# Altium schematic sheet Sheet4.SchDoc
size A4
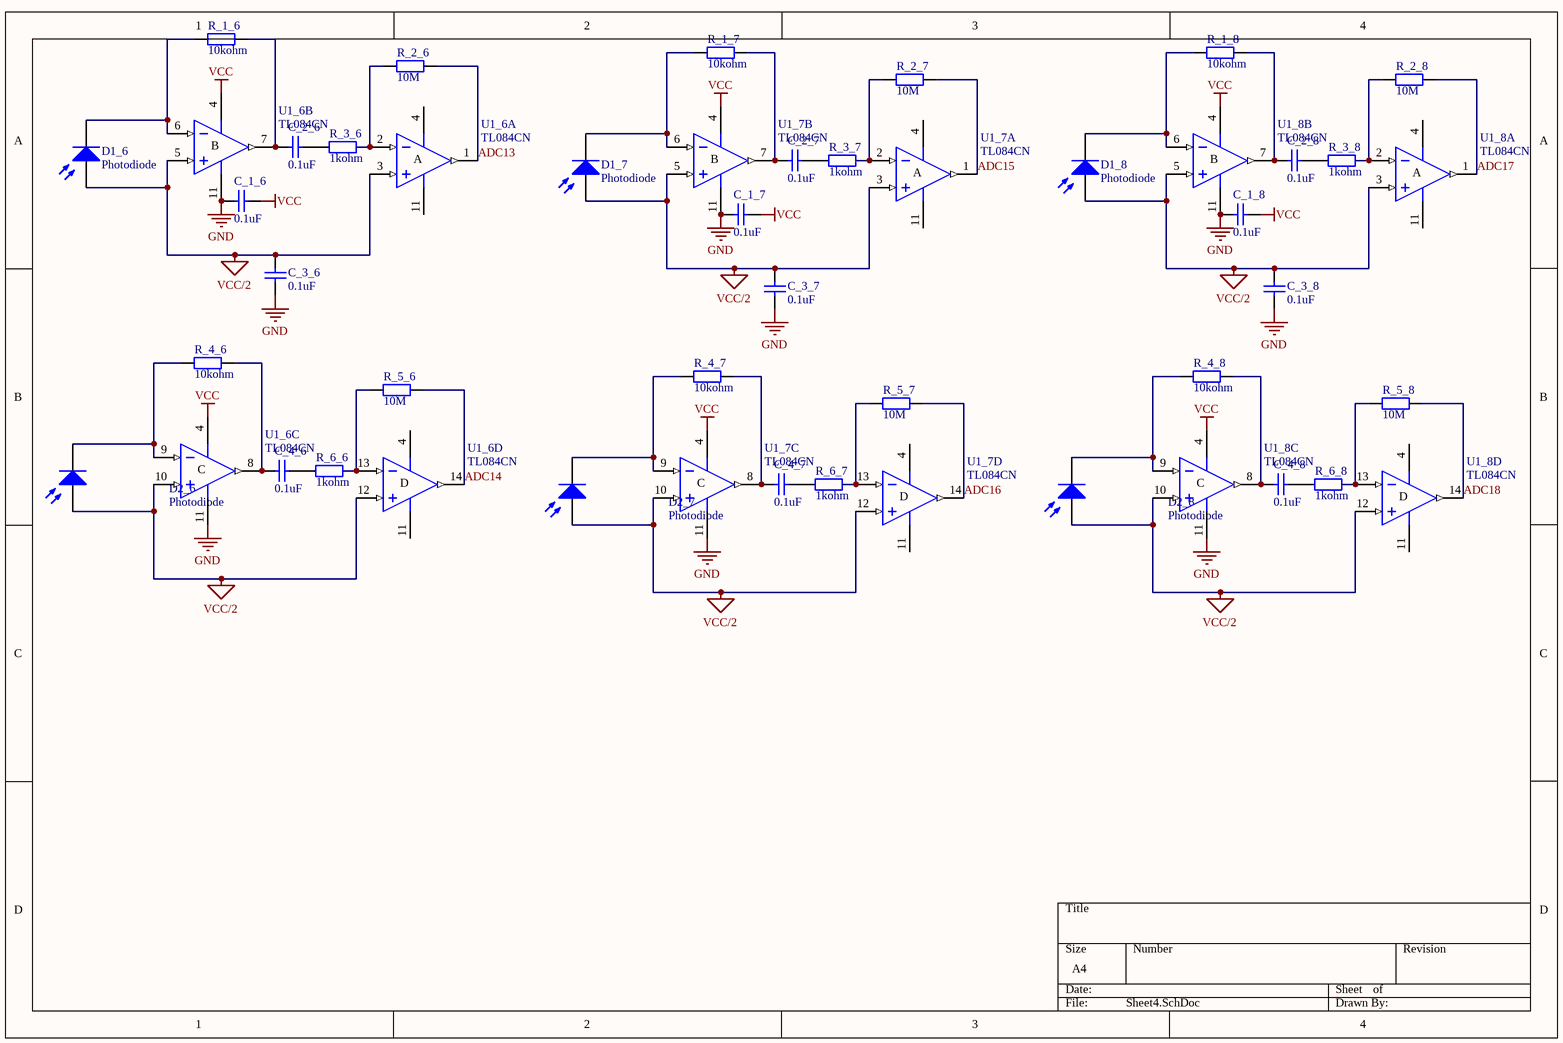
[diagram p0: Sheet4.SchDoc]

## Parts
C_1_6  0.1uF  [cms805 - mini]
C_1_7  0.1uF  [cms805 - mini]
C_1_8  0.1uF  [cms805 - mini]
C_2_6  0.1uF  [cms805 - mini]
C_2_7  0.1uF  [cms805 - mini]
C_2_8  0.1uF  [cms805 - mini]
C_3_6  0.1uF  [cms805 - mini]
C_3_7  0.1uF  [cms805 - mini]
C_3_8  0.1uF  [cms805 - mini]
C_4_6  0.1uF  [cms805 - mini]
C_4_7  0.1uF  [cms805 - mini]
C_4_8  0.1uF  [cms805 - mini]
D1_6  Photodiode  [TEMD1000]
D1_7  Photodiode  [TEMD1000]
D1_8  Photodiode  [TEMD1000]
D2_6  Photodiode  [TEMD1000]
D2_7  Photodiode  [TEMD1000]
D2_8  Photodiode  [TEMD1000]
R_1_6  10kohm  [cms805 - mini]
R_1_7  10kohm  [cms805 - mini]
R_1_8  10kohm  [cms805 - mini]
R_2_6  10M  [cms805 - mini]
R_2_7  10M  [cms805 - mini]
R_2_8  10M  [cms805 - mini]
R_3_6  1kohm  [cms805 - mini]
R_3_7  1kohm  [cms805 - mini]
R_3_8  1kohm  [cms805 - mini]
R_4_6  10kohm  [cms805 - mini]
R_4_7  10kohm  [cms805 - mini]
R_4_8  10kohm  [cms805 - mini]
R_5_6  10M  [cms805 - mini]
R_5_7  10M  [cms805 - mini]
R_5_8  10M  [cms805 - mini]
R_6_6  1kohm  [cms805 - mini]
R_6_7  1kohm  [cms805 - mini]
R_6_8  1kohm  [cms805 - mini]
U1_6  TL084CN  [TSSOP14]  (parts A,B,C,D of 4)
U1_7  TL084CN  [TSSOP14]  (parts A,B,C,D of 4)
U1_8  TL084CN  [TSSOP14]  (parts A,B,C,D of 4)

## Nets
GND: C_1_6.1 C_1_7.1 C_1_8.1 C_3_6.1 C_3_7.1 C_3_8.1 U1_6.11(V-) U1_7.11(V-) U1_8.11(V-)
VCC: C_1_6.2 C_1_7.2 C_1_8.2 U1_6.4(V+) U1_7.4(V+) U1_8.4(V+)
VCC/2: C_3_6.2 C_3_7.2 C_3_8.2 D1_6.1(A) D1_7.1(A) D1_8.1(A) D2_6.1(A) D2_7.1(A) D2_8.1(A) U1_6.3(IN+) U1_6.5(IN+) U1_6.10(IN+) U1_6.12(IN+) U1_7.3(IN+) U1_7.5(IN+) U1_7.10(IN+) U1_7.12(IN+) U1_8.3(IN+) U1_8.5(IN+) U1_8.10(IN+) U1_8.12(IN+)
ADC13: R_2_6.2 U1_6.1(OUT)
ADC14: R_5_6.2 U1_6.14(OUT)
ADC15: R_2_7.2 U1_7.1(OUT)
ADC16: R_5_7.2 U1_7.14(OUT)
ADC17: R_2_8.2 U1_8.1(OUT)
ADC18: R_5_8.2 U1_8.14(OUT)
NetC_2_6_1: C_2_6.1 R_3_6.1
NetC_2_6_2: C_2_6.2 R_1_6.2 U1_6.7(OUT)
NetC_2_7_1: C_2_7.1 R_3_7.1
NetC_2_7_2: C_2_7.2 R_1_7.2 U1_7.7(OUT)
NetC_2_8_1: C_2_8.1 R_3_8.1
NetC_2_8_2: C_2_8.2 R_1_8.2 U1_8.7(OUT)
NetC_4_6_1: C_4_6.1 R_6_6.1
NetC_4_6_2: C_4_6.2 R_4_6.2 U1_6.8(OUT)
NetC_4_7_1: C_4_7.1 R_6_7.1
NetC_4_7_2: C_4_7.2 R_4_7.2 U1_7.8(OUT)
NetC_4_8_1: C_4_8.1 R_6_8.1
NetC_4_8_2: C_4_8.2 R_4_8.2 U1_8.8(OUT)
NetD1_6_2: D1_6.2(K) R_1_6.1 U1_6.6(IN-)
NetD1_7_2: D1_7.2(K) R_1_7.1 U1_7.6(IN-)
NetD1_8_2: D1_8.2(K) R_1_8.1 U1_8.6(IN-)
NetD2_6_2: D2_6.2(K) R_4_6.1 U1_6.9(IN-)
NetD2_7_2: D2_7.2(K) R_4_7.1 U1_7.9(IN-)
NetD2_8_2: D2_8.2(K) R_4_8.1 U1_8.9(IN-)
NetR_2_6_1: R_2_6.1 R_3_6.2 U1_6.2(IN-)
NetR_2_7_1: R_2_7.1 R_3_7.2 U1_7.2(IN-)
NetR_2_8_1: R_2_8.1 R_3_8.2 U1_8.2(IN-)
NetR_5_6_1: R_5_6.1 R_6_6.2 U1_6.13(IN-)
NetR_5_7_1: R_5_7.1 R_6_7.2 U1_7.13(IN-)
NetR_5_8_1: R_5_8.1 R_6_8.2 U1_8.13(IN-)

## Notes on the sheet
- (in symbol TL084CN, part A) A
- (in symbol TL084CN, part B) B
- (in symbol TL084CN, part C) C
- (in symbol TL084CN, part D) D

## Library data of the parts
C_1_6-C_1_8 C_2_6-C_2_8 C_3_6-C_3_8 C_4_6-C_4_8 = Capa
R_1_6-R_1_8 R_2_6-R_2_8 R_3_6-R_3_8 R_4_6-R_4_8 R_5_6-R_5_8 R_6_6-R_6_8 = Resistance
U1_6-U1_8 = TL084CN: General-Purpose J-FET Quad Operational Amplifier; Published: 24-Aug-2001; LatestRevisionDate: 06-Jun-2005; LatestRevisionNote: Stylized 3D Model Added.; DatasheetVersion: Jan-1999; PackageVersion: Jan-1997; PackageReference: DIP14; Publisher: Altium Limited; PackageDescription: DIP; 14 Leads; Row Spacing 7.62 mm; Pitch 2.54 mm; ComponentLink1Description: Manufacturer Link; ComponentLink1URL: http://www.st.com/; ComponentLink2Description: Datasheet; ComponentLink2URL: http://www.st.com/stonline/products/literature/ds/2301/tl084.pdf
D1_6-D1_8 D2_6-D2_8 = Photodiode: Published: 24-Mar-1999; LatestRevisionDate: 17-Jul-2002; LatestRevisionNote: Re-released for DXP Platform.; PackageReference: PIN2; Publisher: Altium Limited